# EAGLE schematic aux power systems1.2 (EAGLE 6.5.0)
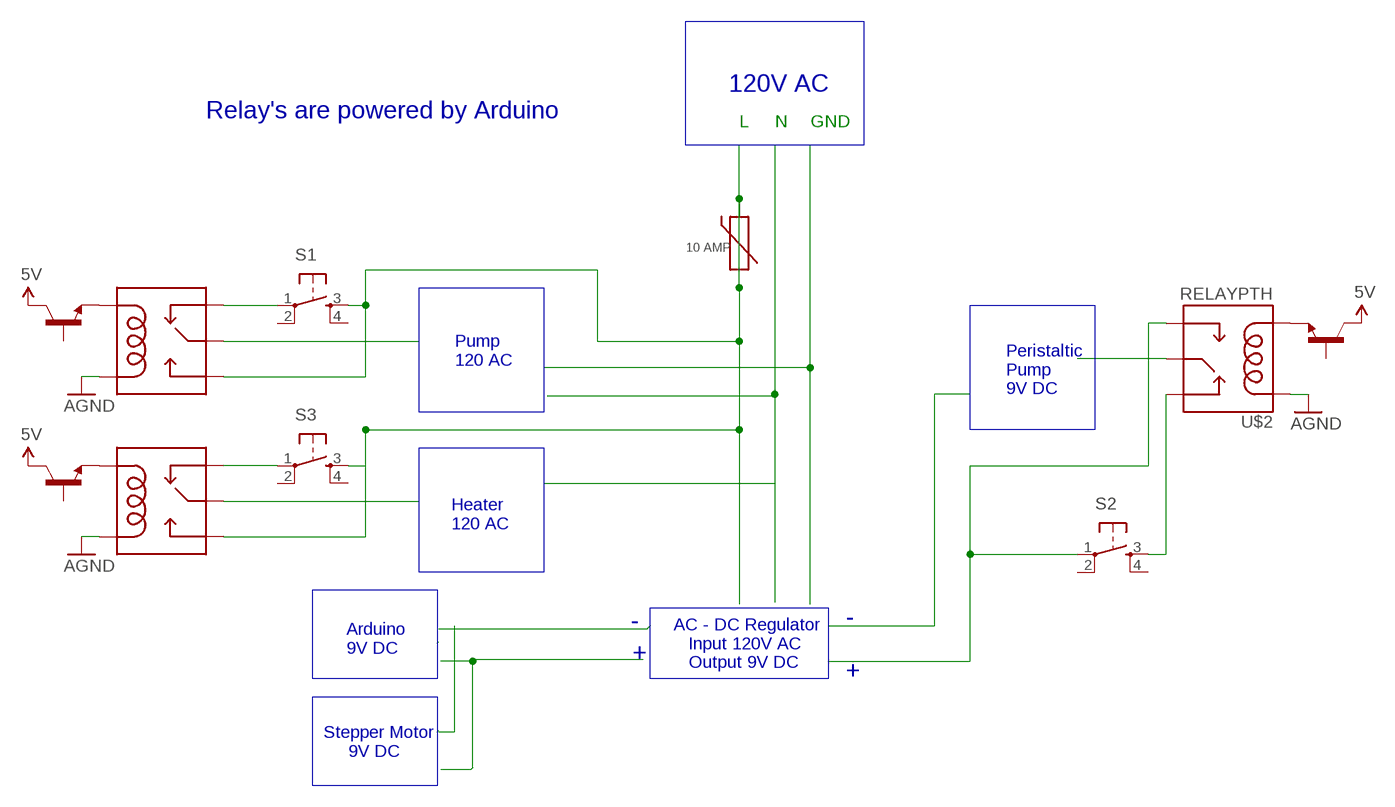
[diagram p0: schematic, sheet 1]

## Parts
F1  PTC0603  [0603]
S1  TAC_SWITCHPTH  [TACTILE-PTH]
S2  TAC_SWITCHPTH  [TACTILE-PTH]
S3  TAC_SWITCHPTH  [TACTILE-PTH]
U$2  RELAYPTH  [RELAY-G5Q]
U$3  RELAYPTH  [RELAY-G5Q]
U$4  RELAYPTH  [RELAY-G5Q]
U$9  BC847PN  [SOT363]
U$13  BC847PN  [SOT363]
U$15  BC847PN  [SOT363]

## Nets
5V: U$9.3(C) U$13.3(C)
6V: U$15.3(C) ; supply symbol labelled 5V
AGND: U$2.5(COIL1) U$3.1(COIL2) U$4.1(COIL2)
B$2: U$3.2(MAIN) U$4.2(MAIN)
B$3: S2.1 U$2.3(NO)
N$1: U$3.5(COIL1) U$9.4(E)
N$2: U$4.5(COIL1) U$13.4(E)
N$3: U$2.1(COIL2) U$15.4(E)
N$4: S2.3 U$2.4(NC)
N$5: U$2.2(MAIN)
N$6: F1.1 F1.2 S1.3 S3.3 U$3.3(NO) U$4.3(NO)
N$9: S3.1 U$4.4(NC)
N$10: S1.1 U$3.4(NC)
Unconnected: S1.2 S1.4 S2.2 S2.4 S3.2 S3.4 U$9.1(E) U$9.2(B) U$9.5(B) U$9.6(C) U$13.1(E) U$13.2(B) U$13.5(B) U$13.6(C) U$15.1(E) U$15.2(B) U$15.5(B) U$15.6(C)

## Buses
B$1
B$2
B$3
B$5

## Notes on the sheet
- 120V AC
- L | N | GND
- Relay's are powered by Arduino
- 10 AMP
- Pump
  120 AC
- Peristaltic 
  Pump
  9V DC
- Heater
  120 AC
- - | -
- Arduino 
  9V DC
- +
- AC - DC Regulator
     Input 120V AC
     Output 9V DC
- +
- Stepper Motor 
       9V DC

## Library data of the parts
F1 = SparkFun-PowerIC:PTC: Resettable Fuse PTC Resettable Fuse. Spark Fun Electronics SKU : COM-08357
S1-S3 = SparkFun-Electromechanical:TAC_SWITCH: Momentary Switch Button commonly used for reset or general input. Spark Fun Electronics SKU : COM-00097 SMT- SWCH-08247
U$2-U$4 = SparkFun-Electromechanical:RELAY: SPDT relay (COM-00101)
U$9 U$13 U$15 = SparkFun-DiscreteSemi:BC847PN: NPN/PNP transistor pair in SOT-363 package